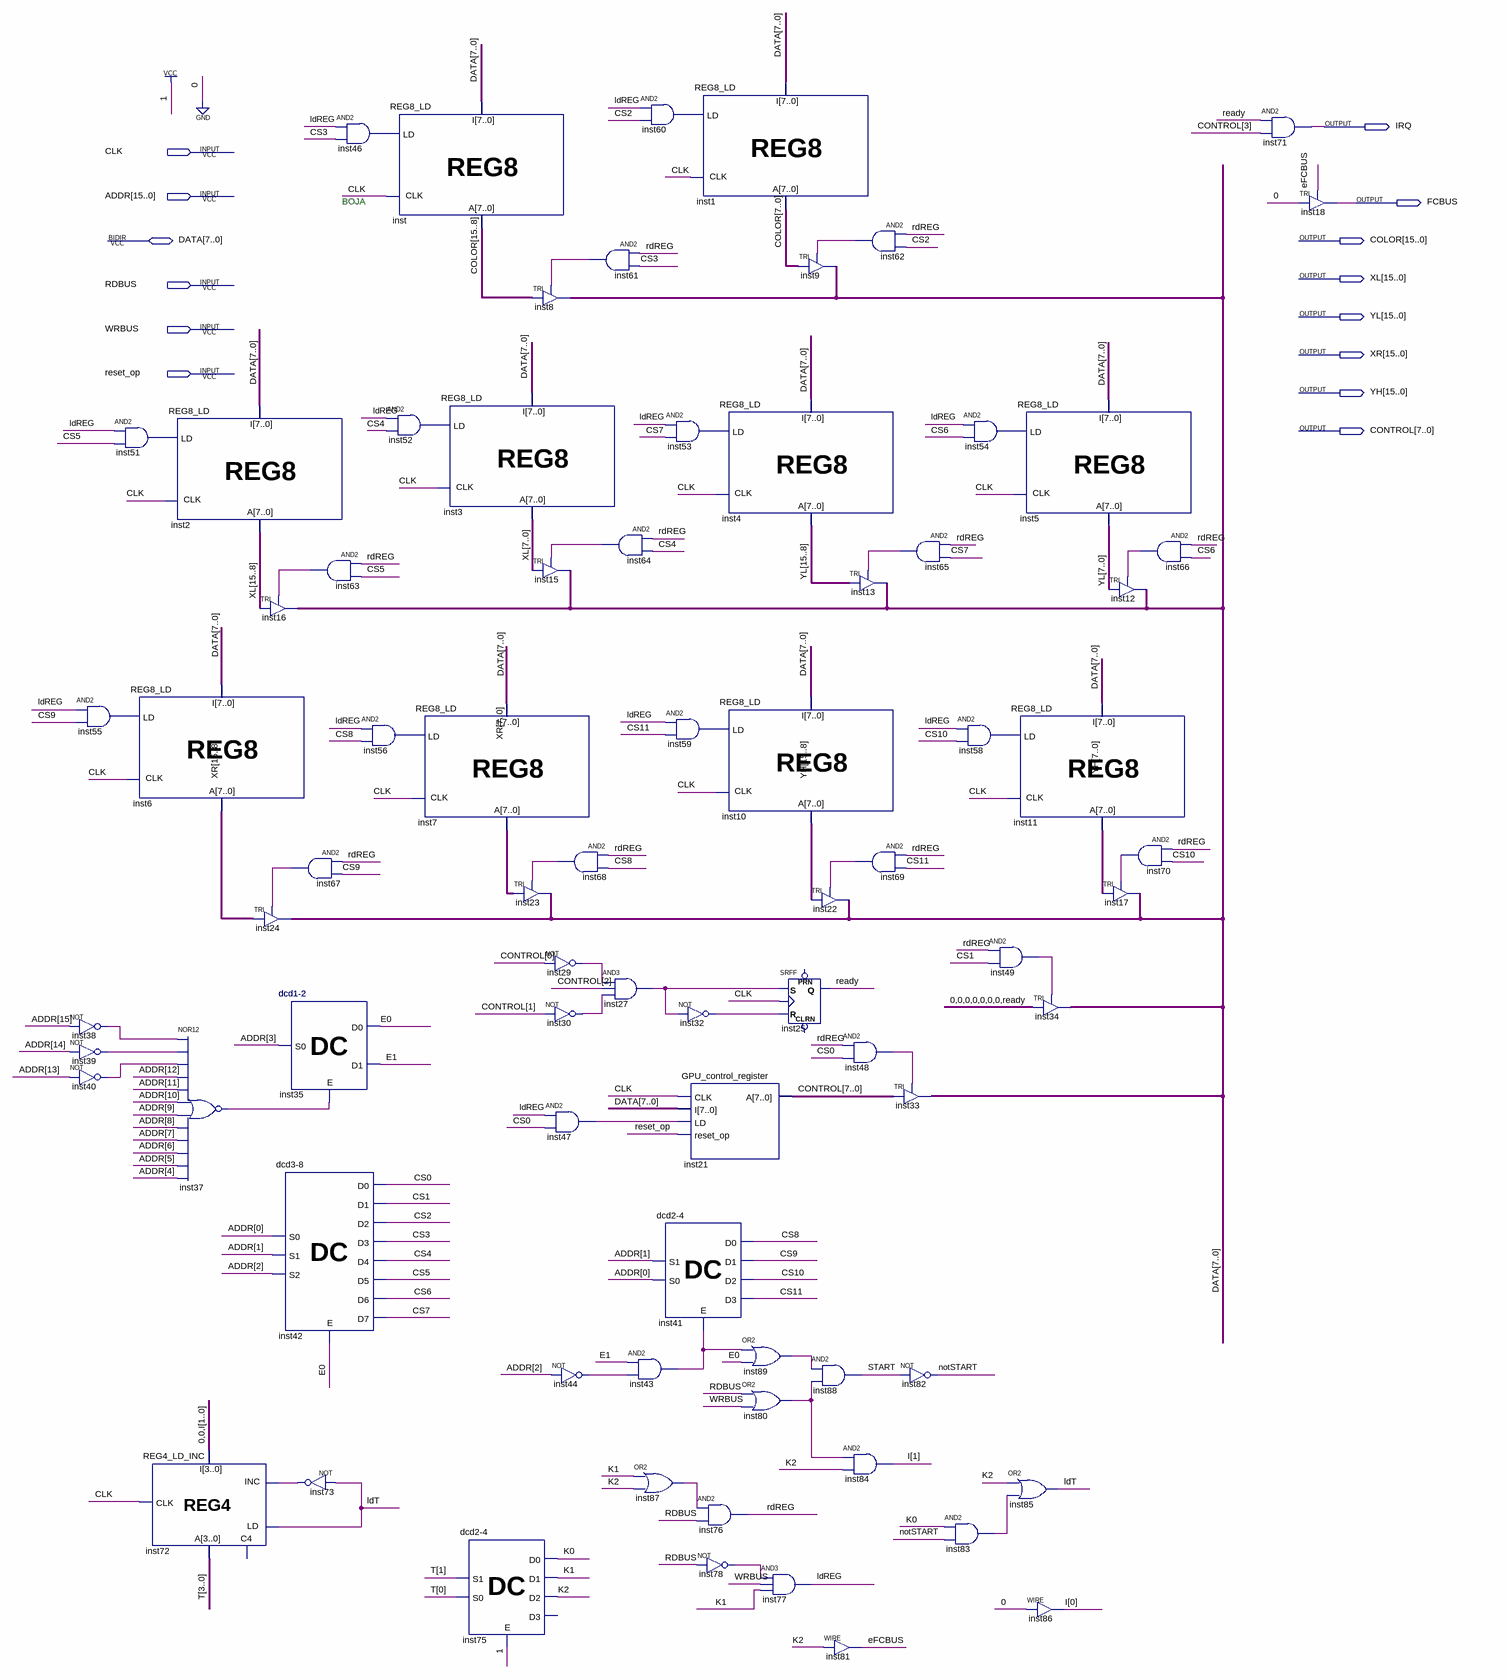
[diagram p0: schematic sheet]
// Quartus schematic GPU_interface.bdf as structural Verilog: 78 symbols, 14 pins
module GPU_interface (
  input  CLK,
  input  [15:0] ADDR,
  input  RDBUS,
  input  WRBUS,
  input  reset_op,
  inout  [7:0] DATA,
  output IRQ,
  output FCBUS,
  output [15:0] COLOR,
  output [15:0] XL,
  output [15:0] YL,
  output [15:0] XR,
  output [15:0] YH,
  output [7:0] CONTROL
);

  wire CS0, CS1, CS2, CS3, CS4, CS5, CS6, CS7, CS8, CS9, CS10, CS11, E0, E1, eFCBUS, inst27_out, inst29_out,
       inst30_out, inst32_out, inst37_out, inst38_out, inst39_out, inst40_out, inst43_out, inst44_out,
       inst46_out, inst47_out, inst48_out, inst49_out, inst51_out, inst52_out, inst53_out, inst54_out,
       inst55_out, inst56_out, inst58_out, inst59_out, inst60_out, inst61_out, inst62_out, inst63_out,
       inst64_out, inst65_out, inst66_out, inst67_out, inst68_out, inst69_out, inst70_out, inst73_out,
       inst78_out, inst80_out, inst83_out, inst87_out, inst89_out, K0, K1, K2, ldREG, ldT, notSTART, rdREG,
       ready, START;
  wire [1:0] I;
  wire [3:0] T;

  and inst55 (inst55_out, ldREG, CS9);
  not inst38 (inst38_out, ADDR[15]);
  not inst39 (inst39_out, ADDR[14]);
  not inst40 (inst40_out, ADDR[13]);
  and inst51 (inst51_out, ldREG, CS5);
  REG8_LD inst6 (.I(DATA), .CLK(CLK), .LD(inst55_out), .A(XR[15:8]));
  REG4_LD_INC inst72 (.LD(ldT), .INC(inst73_out), .CLK(CLK), .I({2'b00, I}), .A(T));  // open: C4
  REG8_LD inst2 (.I(DATA), .CLK(CLK), .LD(inst51_out), .A(XL[15:8]));
  nor inst37 (inst37_out, inst38_out, inst39_out, inst40_out, ADDR[12], ADDR[11], ADDR[10], ADDR[9], ADDR[8], ADDR[7], ADDR[6], ADDR[5], ADDR[4]);
  TRI inst16[7:0] (.IN(XL[15:8]), .OE(inst63_out), .OUT(DATA));
  TRI inst24[7:0] (.IN(XR[15:8]), .OE(inst67_out), .OUT(DATA));
  and inst63 (inst63_out, rdREG, CS5);
  and inst67 (inst67_out, rdREG, CS9);
  \dcd1-2  inst35 (.E(inst37_out), .S0(ADDR[3]), .D0(E0), .D1(E1));
  \dcd3-8  inst42 (
    .E(E0), .S0(ADDR[0]), .S1(ADDR[1]), .S2(ADDR[2]), .D0(CS0), .D1(CS1), .D2(CS2), .D3(CS3), .D4(CS4),
    .D5(CS5), .D6(CS6), .D7(CS7));
  not inst73 (inst73_out, ldT);
  and inst46 (inst46_out, ldREG, CS3);
  and inst56 (inst56_out, ldREG, CS8);
  REG8_LD inst (.I(DATA), .CLK(CLK), .LD(inst46_out), .A(COLOR[15:8]));
  and inst52 (inst52_out, ldREG, CS4);
  REG8_LD inst7 (.I(DATA), .CLK(CLK), .LD(inst56_out), .A(XR[7:0]));
  REG8_LD inst3 (.I(DATA), .CLK(CLK), .LD(inst52_out), .A(XL[7:0]));
  \dcd2-4  inst75 (.E(1'b1), .S1(T[1]), .S0(T[0]), .D0(K0), .D1(K1), .D2(K2));  // open: D3
  TRI inst23[7:0] (.IN(XR[7:0]), .OE(inst68_out), .OUT(DATA));
  TRI inst8[7:0] (.IN(COLOR[15:8]), .OE(inst61_out), .OUT(DATA));
  TRI inst15[7:0] (.IN(XL[7:0]), .OE(inst64_out), .OUT(DATA));
  and inst68 (inst68_out, rdREG, CS8);
  not inst29 (inst29_out, CONTROL[0]);
  not inst30 (inst30_out, CONTROL[1]);
  and inst47 (inst47_out, ldREG, CS0);
  not inst44 (inst44_out, ADDR[2]);
  and inst61 (inst61_out, rdREG, CS3);
  and inst64 (inst64_out, rdREG, CS4);
  and inst27 (inst27_out, inst29_out, CONTROL[2], inst30_out);
  and inst60 (inst60_out, ldREG, CS2);
  and inst53 (inst53_out, ldREG, CS7);
  and inst59 (inst59_out, ldREG, CS11);
  \dcd2-4  inst41 (.E(inst43_out), .S1(ADDR[1]), .S0(ADDR[0]), .D0(CS8), .D1(CS9), .D2(CS10), .D3(CS11));
  and inst43 (inst43_out, E1, inst44_out);
  or inst87 (inst87_out, K1, K2);
  REG8_LD inst1 (.I(DATA), .CLK(CLK), .LD(inst60_out), .A(COLOR[7:0]));
  REG8_LD inst4 (.I(DATA), .CLK(CLK), .LD(inst53_out), .A(YL[15:8]));
  REG8_LD inst10 (.I(DATA), .CLK(CLK), .LD(inst59_out), .A(YH[15:8]));
  not inst32 (inst32_out, inst27_out);
  GPU_control_register inst21 (.CLK(CLK), .I(DATA), .LD(inst47_out), .reset_op(reset_op), .A(CONTROL));
  and inst76 (rdREG, inst87_out, RDBUS);
  not inst78 (inst78_out, RDBUS);
  or inst89 (inst89_out, inst43_out, E0);
  or inst80 (inst80_out, RDBUS, WRBUS);
  and inst77 (ldREG, inst78_out, WRBUS, K1);
  TRI inst9[7:0] (.IN(COLOR[7:0]), .OE(inst62_out), .OUT(DATA));
  TRI inst22[7:0] (.IN(YH[15:8]), .OE(inst69_out), .OUT(DATA));
  SRFF inst25 (.S(inst27_out), .R(inst32_out), .CLK(CLK), .Q(ready));  // open: PRN, CLRN
  and inst88 (START, inst89_out, inst80_out);
  and inst62 (inst62_out, rdREG, CS2);
  TRI inst13[7:0] (.IN(YL[15:8]), .OE(inst65_out), .OUT(DATA));
  and inst69 (inst69_out, rdREG, CS11);
  and inst48 (inst48_out, rdREG, CS0);
  and inst84 (I[1], inst80_out, K2);
  assign eFCBUS = K2;  // WIRE inst81
  and inst65 (inst65_out, rdREG, CS7);
  TRI inst33[7:0] (.IN(CONTROL), .OE(inst48_out), .OUT(DATA));
  not inst82 (notSTART, START);
  and inst54 (inst54_out, ldREG, CS6);
  and inst58 (inst58_out, ldREG, CS10);
  and inst83 (inst83_out, K0, notSTART);
  REG8_LD inst5 (.I(DATA), .CLK(CLK), .LD(inst54_out), .A(YL[7:0]));
  REG8_LD inst11 (.I(DATA), .CLK(CLK), .LD(inst58_out), .A(YH[7:0]));
  and inst49 (inst49_out, rdREG, CS1);
  or inst85 (ldT, K2, inst83_out);
  TRI inst34[7:0] (.IN({{7{1'b0}}, ready}), .OE(inst49_out), .OUT(DATA));
  assign I[0] = 1'b0;  // WIRE inst86
  TRI inst12[7:0] (.IN(YL[7:0]), .OE(inst66_out), .OUT(DATA));
  and inst70 (inst70_out, rdREG, CS10);
  TRI inst17[7:0] (.IN(YH[7:0]), .OE(inst70_out), .OUT(DATA));
  and inst66 (inst66_out, rdREG, CS6);
  and inst71 (IRQ, ready, CONTROL[3]);
  TRI inst18 (.IN(1'b0), .OE(eFCBUS), .OUT(FCBUS));

  // Notes on the sheet:
  //   BOJA
endmodule
